# Altium schematic sheet Switch_board_left.SchDoc
size A; SheetNumber: 1; SheetTotal: 1
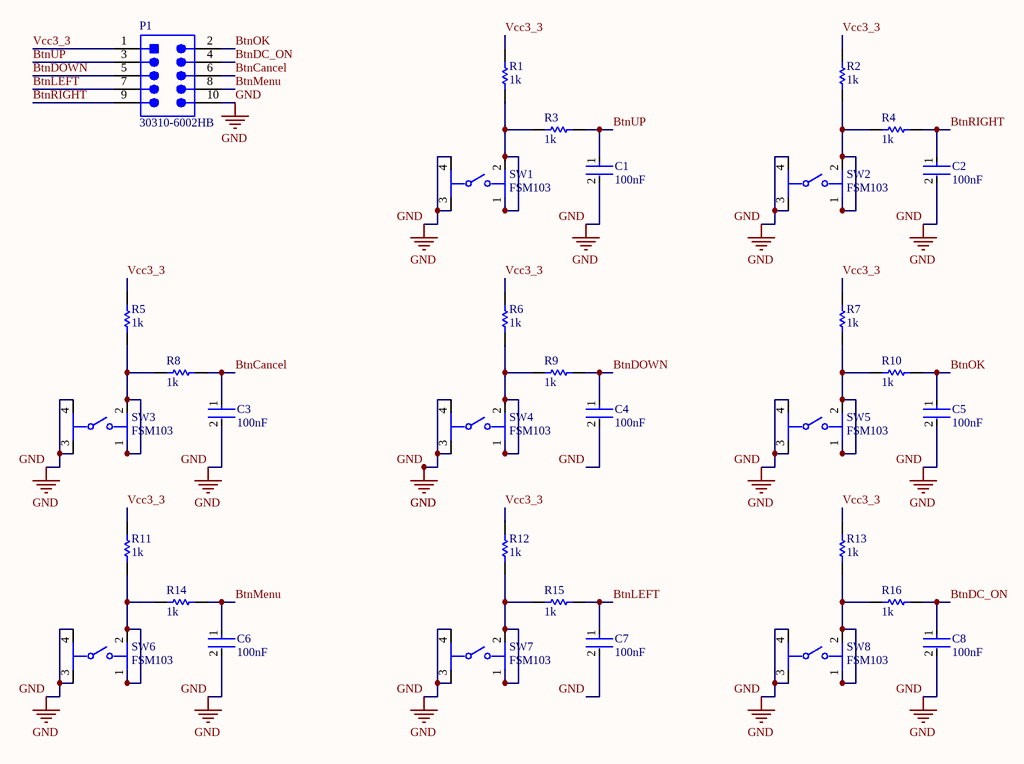
[diagram p0: Switch_board_left.SchDoc]

## Parts
C1  100nF  [FP-0805-L_2_01_0_2-W_1_25-IPC_B]
C2  100nF  [FP-0805-L_2_01_0_2-W_1_25-IPC_B]
C3  100nF  [FP-0805-L_2_01_0_2-W_1_25-IPC_B]
C4  100nF  [FP-0805-L_2_01_0_2-W_1_25-IPC_B]
C5  100nF  [FP-0805-L_2_01_0_2-W_1_25-IPC_B]
C6  100nF  [FP-0805-L_2_01_0_2-W_1_25-IPC_B]
C7  100nF  [FP-0805-L_2_01_0_2-W_1_25-IPC_B]
C8  100nF  [FP-0805-L_2_01_0_2-W_1_25-IPC_B]
P1  30310-6002HB  [3M-30310-6002HB-10_V]
R1  1k  [RESC2013X50X30LL20T20]
R2  1k  [RESC2013X50X30LL20T20]
R3  1k  [RESC2013X50X30LL20T20]
R4  1k  [RESC2013X50X30LL20T20]
R5  1k  [RESC2013X50X30LL20T20]
R6  1k  [RESC2013X50X30LL20T20]
R7  1k  [RESC2013X50X30LL20T20]
R8  1k  [RESC2013X50X30LL20T20]
R9  1k  [RESC2013X50X30LL20T20]
R10  1k  [RESC2013X50X30LL20T20]
R11  1k  [RESC2013X50X30LL20T20]
R12  1k  [RESC2013X50X30LL20T20]
R13  1k  [RESC2013X50X30LL20T20]
R14  1k  [RESC2013X50X30LL20T20]
R15  1k  [RESC2013X50X30LL20T20]
R16  1k  [RESC2013X50X30LL20T20]
SW1  FSM103  [FP-FSM103-MFG]
SW2  FSM103  [FP-FSM103-MFG]
SW3  FSM103  [FP-FSM103-MFG]
SW4  FSM103  [FP-FSM103-MFG]
SW5  FSM103  [FP-FSM103-MFG]
SW6  FSM103  [FP-FSM103-MFG]
SW7  FSM103  [FP-FSM103-MFG]
SW8  FSM103  [FP-FSM103-MFG]

## Nets
GND: C1.2 C2.2 C3.2 C4.2 C5.2 C6.2 C7.2 C8.2 P1.10 SW1.3 SW1.4 SW2.3 SW2.4 SW3.3 SW3.4 SW4.3 SW4.4 SW5.3 SW5.4 SW6.3 SW6.4 SW7.3 SW7.4 SW8.3 SW8.4
BtnCancel: C3.1 P1.6 R8.1
BtnDC_ON: C8.1 P1.4 R16.1
BtnDOWN: C4.1 P1.5 R9.1
BtnLEFT: C7.1 P1.7 R15.1
BtnMenu: C6.1 P1.8 R14.1
BtnOK: C5.1 P1.2 R10.1
BtnRIGHT: C2.1 P1.9 R4.1
BtnUP: C1.1 P1.3 R3.1
Vcc3_3: P1.1 R1.2 R2.2 R5.2 R6.2 R7.2 R11.2 R12.2 R13.2
NetR1_1: R1.1 R3.2 SW1.1 SW1.2
NetR2_1: R2.1 R4.2 SW2.1 SW2.2
NetR5_1: R5.1 R8.2 SW3.1 SW3.2
NetR6_1: R6.1 R9.2 SW4.1 SW4.2
NetR7_1: R7.1 R10.2 SW5.1 SW5.2
NetR11_1: R11.1 R14.2 SW6.1 SW6.2
NetR12_1: R12.1 R15.2 SW7.1 SW7.2
NetR13_1: R13.1 R16.2 SW8.1 SW8.2

## Library data of the parts
C1-C8 = CMP-2007-04174-2: General Purpose Ceramic Capacitor, 0805, 100nF, 10%, X7R, 15%, 100V; Packaging: Tape and Reel; Min Operating Temperature: -55°C; Dielectric Material: Ceramic; Height: 1.4mm; Voltage Rating: 100V; Termination: SMD/SMT; Case Code (Imperial): 0805; Case Code (Metric): 2012; Case/Package: 0805; Construction: Flat; Radiation Hardening: No; Series: -; Dielectric: X7R; Package Quantity: 2000; Mount: Surface Mount; Capacitance: 100nF; Contact Plating: Tin; Voltage: 100V; Lead Free: Lead Free; Depth: 1.25mm; RoHS Compliant: Yes; Number of Pins: 2; Max Operating Temperature: 125°C; Length: 2.01mm; Voltage Rating (DC): 100V; Thickness: 0.055inch; REACH SVHC: No SVHC; Width: 0.049inch; Tolerance: 10%
P1 = CMP-2000-05031-1: Male Header, Pitch 2.54 mm, 2 x 5 Position, Height 9.3 mm, Tail Length 2.79 mm, -55 to 105 degC, RoHS, Bulk; Manufacturer: 3M; Current Rating: 1A; Brand: 3MElectronicSolutionsDivision; Mounting Angle: Straight; Number of Positions: 10Position; Mating Post Length: 5.99mm; Pitch: 2.54mm; Manufacturer URL: http://www.3m.com/; Factory Pack Quantity: 1000; Mounting Style: StraightPin; Number of Rows: 2Row; Termination Post Length: 2.79mm; Contact Gender: Pin(Male); Contact Material: Brass; Termination Style: ThroughHole; Product: Headers; Packaging: Tray; Product Category: Headers&WireHousings; Type: Shrouded; Datasheet URL: http://datasheet.octopart.com/30310-6002HB-3M-datasheet-11537585.pdf; Datasheet Version: Apr-12; Contact Plating: Gold; Row Spacing: 2.54mm; Housing Material: Polyester; Series: 303; RoHS: Details
R1-R16 = CMP-2001-04896-1: Manufacturer: Vishay Dale; Part Number: CRCW08050000Z0EA
SW1-SW8 = CMP-03407-000037-1: SWITCH TACTILE SPST-NO 0.05A 24V; Contact Resistance: 100mR; Actuator Length: 3.4mm; Switch Function: Off-Mom; Operating Force: 1.57N; Illumination Type: Non-Illuminated; Voltage Rating (DC): 12V; Current Rating: 50mA; Actuator Material: Polyester; Switch Travel: 0.3mm; Throw Configuration: SPST; Actuator Color: Black; Mechanical Life: 100000Cycles; Depth: 14.1mm; RoHS Compliant: Yes; Max Operating Temperature: 85°C; Mount: Through Hole; Min Operating Temperature: -35°C; Contact Plating: Silver; Width: 12mm; Package Quantity: 400; Radiation Hardening: No; Series: FSM100 ~ 104; Type: Switch; Termination: PC Pins; Voltage Rating: 24V; Contact Material: Brass; Max Voltage Rating (DC): 12V; Contact Current Rating: 50mA; Length: 12mm; Packaging: Loose Piece; Orientation: Straight; Max Current Rating: 50mA; Electrical Life: 100000Cycles